# EAGLE design main (EAGLE 8.7.1)
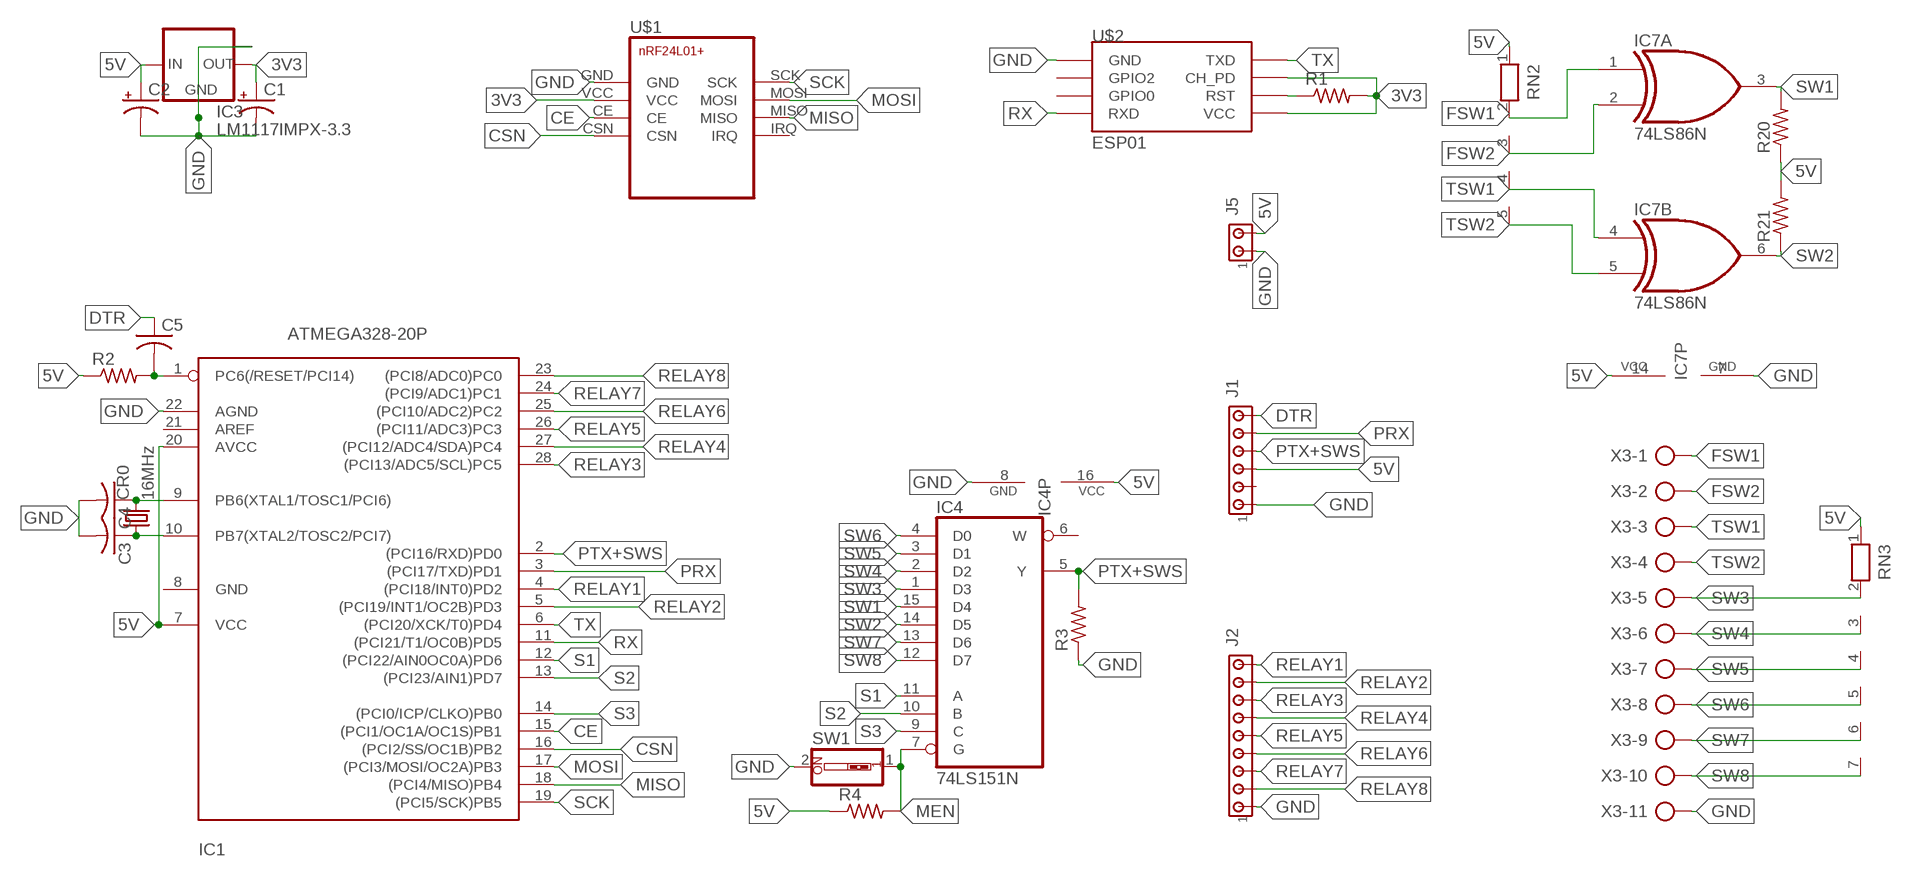
[diagram p0: schematic, sheet 1]

## Parts
C1  CPOL-USE2,5-6E  [E2,5-6E]
C2  CPOL-USE2,5-6E  [E2,5-6E]
C3  C-USC1206  [C1206]
C4  C-USC1206  [C1206]
C5  C-USC1206  [C1206]
CR0  16MHz  CRYSTALHC18U-V  [HC18U-V]
IC1  ATMEGA328-20P  [DIL28-3]
IC3  LM1117IMPX-3.3  [SOT223]
IC4  74LS151N  [DIL16]
IC7  74LS86N  [DIL14]
J1  MTA06-100  [10X06MTA]
J2  MTA09-100  [10X09MTA]
J5  MTA02-100  [10X02MTA]
R1  R-US_R1206  [R1206]
R2  R-US_R1206  [R1206]
R3  R-US_R1206  [R1206]
R4  R-US_R1206  [R1206]
R20  R-US_0204/7  [0204/7]
R21  R-US_R1206  [R1206]
RN2  RN04  [RN-5]
RN3  RN06  [RN-7]
SW1  SW_DIP-1  [EDG-01]
U$1  NRF24L01+  [NRF24L01+]
U$2  ESP01  [ESP01]
X3  AK300/11  [AK300/11]

## Nets
3V3: C1.+ IC3.2(OUT) R1.2 U$1.VCC U$2.CH_PD U$2.VCC
5V: C2.+ IC1.7(VCC) IC1.20(AVCC) IC3.3(IN) IC4.16(VCC) IC7.14(P:VCC) J1.3 J5.2 R2.1 R4.1 R20.1 R21.2 RN2.1 RN3.1
CE: IC1.15((PCI1/OC1A/OC1S)PB1) U$1.CE
CR1: C4.1 CR0.2 IC1.9(PB6(XTAL1/TOSC1/PCI6))
CR2: C3.1 CR0.1 IC1.10(PB7(XTAL2/TOSC2/PCI7))
CSN: IC1.16((PCI2/SS/OC1B)PB2) U$1.CSN
DTR: C5.1 J1.6
ERST: R1.1 U$2.RST
FSW1: IC7.1(A:I0) RN2.2 X3.1
FSW2: IC7.2(A:I1) RN2.3 X3.2
GND: C1.- C2.- C3.2 C4.2 IC1.22(AGND) IC3.1(GND) IC3.TAB(OUT1) IC4.8(GND) IC7.7(P:GND) J1.1 J2.1 J5.1 R3.1 SW1.2 U$1.GND U$2.GND X3.11
MEN: IC4.7(G) R4.2 SW1.1
MISO: IC1.18((PCI4/MISO)PB4) U$1.MISO
MOSI: IC1.17((PCI3/MOSI/OC2A)PB3) U$1.MOSI
MRST: C5.2 IC1.1(PC6(/RESET/PCI14)) R2.2
PRX: IC1.3((PCI17/TXD)PD1) J1.5
PTX+SWS: IC1.2((PCI16/RXD)PD0) IC4.5(Y) J1.4 R3.2
RELAY1: IC1.4((PCI18/INT0)PD2) J2.9
RELAY2: IC1.5((PCI19/INT1/OC2B)PD3) J2.8
RELAY3: IC1.28((PCI13/ADC5/SCL)PC5) J2.7
RELAY4: IC1.27((PCI12/ADC4/SDA)PC4) J2.6
RELAY5: IC1.26((PCI11/ADC3)PC3) J2.5
RELAY6: IC1.25((PCI10/ADC2)PC2) J2.4
RELAY7: IC1.24((PCI9/ADC1)PC1) J2.3
RELAY8: IC1.23((PCI8/ADC0)PC0) J2.2
RX: IC1.11((PCI21/T1/OC0B)PD5) U$2.RX(RXD)
S1: IC1.12((PCI22/AIN0OC0A)PD6) IC4.11(A)
S2: IC1.13((PCI23/AIN1)PD7) IC4.10(B)
S3: IC1.14((PCI0/ICP/CLKO)PB0) IC4.9(C)
SCK: IC1.19((PCI5/SCK)PB5) U$1.SCK
SW1: IC4.15(D4) IC7.3(A:O) R20.2
SW2: IC4.14(D5) IC7.6(B:O) R21.1
SW3: IC4.1(D3) RN3.2 X3.5
SW4: IC4.2(D2) RN3.3 X3.6
SW5: IC4.3(D1) RN3.4 X3.7
SW6: IC4.4(D0) RN3.5 X3.8
SW7: IC4.13(D6) RN3.6 X3.9
SW8: IC4.12(D7) RN3.7 X3.10
TSW1: IC7.4(B:I0) RN2.4 X3.3
TSW2: IC7.5(B:I1) RN2.5 X3.4
TX: IC1.6((PCI20/XCK/T0)PD4) U$2.TX(TXD)
Unconnected: IC1.8(GND) IC1.21(AREF) IC4.6(W) IC7.8(C:O) IC7.9(C:I0) IC7.10(C:I1) IC7.11(D:O) IC7.12(D:I0) IC7.13(D:I1) J1.2 U$1.IRQ U$2.GPIO0 U$2.GPIO2

## Library data of the parts
C1 C2 = adafruit:CPOL-US: POLARIZED CAPACITOR, American symbol
C3-C5 = adafruit:C-US: CAPACITOR, American symbol
CR0 = adafruit:CRYSTAL: CRYSTAL; OC_FARNELL: unknown; OC_NEWARK: unknown
IC1 = atmega328:ATMEGA328*P: MICROCONTROLLER 32 kBytes FLASH 2 kBytes SRAM 1 kBytes EEPROM USART 8-channel 10 bit ADC
IC3 = lm1117:LM1117IMPX-*
IC4 = 74xx-us:74*151: Data SELECTOR/MULTIPLEXER
IC7 = 74xx-us:74*86: Quad 2-input EXCLUSIV-OR (XOR) gate
J1 = con-amp:MTA06-100: AMP connector Connection corrected 2014-09-19
J2 = con-amp:MTA09-100: AMP connector
J5 = con-amp:MTA02-100: AMP connector
R1-R4 R20 R21 = adafruit:R-US_: RESISTOR, American symbol
RN2 = resistor-net:RN04: RESISTOR NETWORK; OC_FARNELL: unknown; OC_NEWARK: unknown
RN3 = resistor-net:RN06: RESISTOR NETWORK; OC_FARNELL: unknown; OC_NEWARK: unknown
SW1 = special:SW_DIP-1: DIP SWITCH
U$1 = nrf24l01:NRF24L01+: nRF24L01+ Transceiver Module
U$2 = esp8266:ESP01: ESP8266 Wifi module 01
X3 = con-ptr500:AK300/11: CONNECTOR; OC_FARNELL: unknown; OC_NEWARK: unknown

## Board
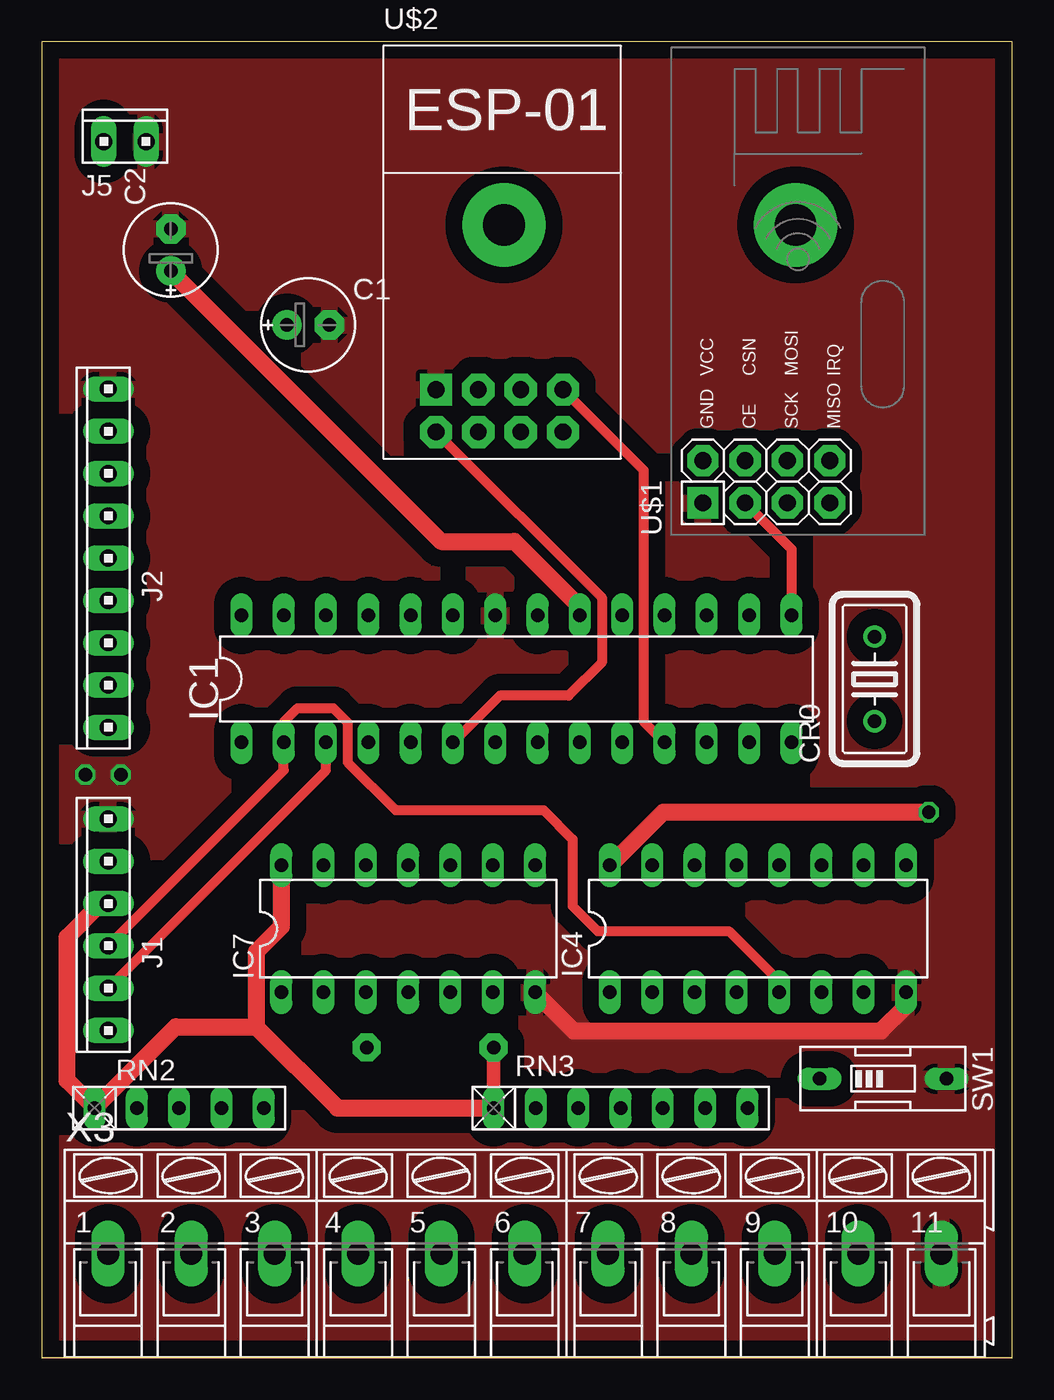
[diagram p1: board, top side]
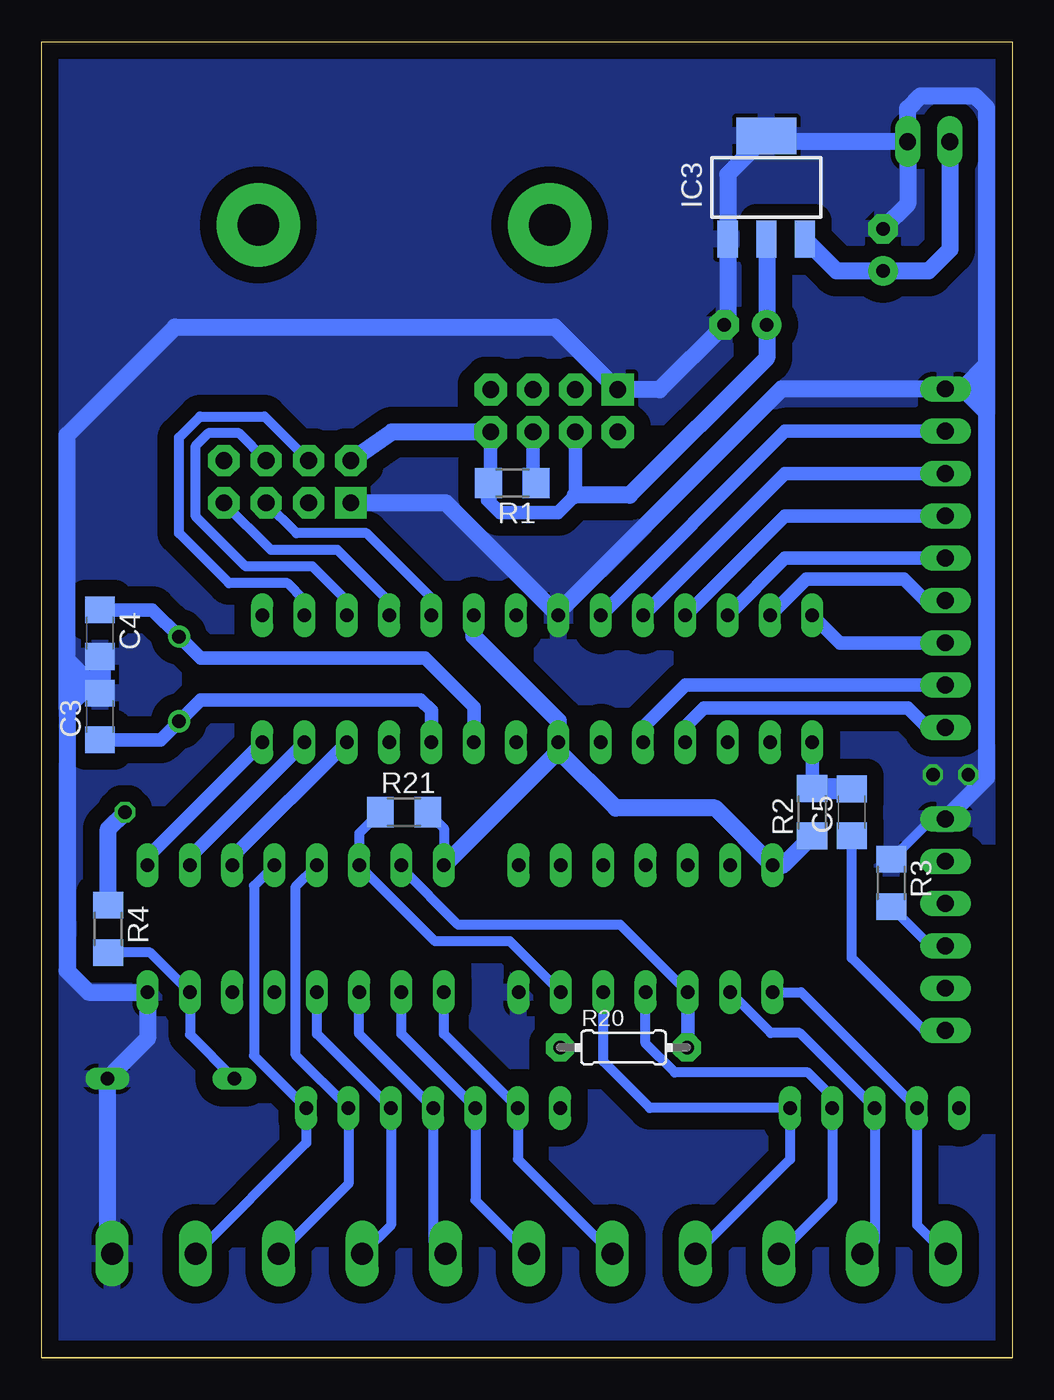
[diagram p2: board, bottom side, seen from below]

Size 58.25 x 79 mm. Coordinates in mm from the lower left corner, seen from the top.
Outline: 0,0 58.25,0
Outline: 58.25,0 0,0
Outline: 58.25,0 58.25,79 0,79 0,0
Copper layers (1*16): Top 0.035mm / dielectric 1.5mm / Bottom 0.035mm
Design rules "default": minimum track width 6mil, minimum drill 0.35mm, track to track 6mil, track to pad 6mil, pad to pad 6mil, via to via 6mil, smd to smd 6mil, copper to edge 40mil, drill to drill 6mil, minimum pad ring 10mil, minimum via ring 8mil, stop-mask expansion 4mil, vias tented up to drill 0mil, thermal gap 10mil

### Footprints (pad centres in the part's own frame; a part is rotated, then mirrored left to right if it is on the bottom)
E2,5-6E = drill 0.813 pad 1.778: + -1.27,0 | drill 0.813 pad 1.778 octagon: - 1.27,0
C1206 = smd 1.6 x 1.8: 1 -1.4,0; 2 1.4,0
HC18U-V = drill 0.813: 1 -2.54,0; 2 2.54,0
DIL28-3 = drill 0.813 long: 1 -16.51,-3.81; 2 -13.97,-3.81; 3 -11.43,-3.81; 4 -8.89,-3.81; 5 -6.35,-3.81; 6 -3.81,-3.81; 7 -1.27,-3.81; 8 1.27,-3.81; 9 3.81,-3.81; 10 6.35,-3.81; 11 8.89,-3.81; 12 11.43,-3.81; 13 13.97,-3.81; 14 16.51,-3.81; 15 16.51,3.81; 16 13.97,3.81; 17 11.43,3.81; 18 8.89,3.81; 19 6.35,3.81; 20 3.81,3.81; 21 1.27,3.81; 22 -1.27,3.81; 23 -3.81,3.81; 24 -6.35,3.81; 25 -8.89,3.81; 26 -11.43,3.81; 27 -13.97,3.81; 28 -16.51,3.81
SOT223 = smd 1.219 x 2.235: 1 -2.311,-3.099; 2 0,-3.099; 3 2.311,-3.099 | smd 3.6 x 2.2: TAB 0,3.099
DIL16 = drill 0.813 long: 1 -8.89,-3.81; 2 -6.35,-3.81; 3 -3.81,-3.81; 4 -1.27,-3.81; 5 1.27,-3.81; 6 3.81,-3.81; 7 6.35,-3.81; 8 8.89,-3.81; 9 8.89,3.81; 10 6.35,3.81; 11 3.81,3.81; 12 1.27,3.81; 13 -1.27,3.81; 14 -3.81,3.81; 15 -6.35,3.81; 16 -8.89,3.81
DIL14 = drill 0.813 long: 1 -7.62,-3.81; 2 -5.08,-3.81; 3 -2.54,-3.81; 4 0,-3.81; 5 2.54,-3.81; 6 5.08,-3.81; 7 7.62,-3.81; 8 7.62,3.81; 9 5.08,3.81; 10 2.54,3.81; 11 0,3.81; 12 -2.54,3.81; 13 -5.08,3.81; 14 -7.62,3.81
10X06MTA = drill 1.016 long: 1 6.35,0; 2 3.81,0; 3 1.27,0; 4 -1.27,0; 5 -3.81,0; 6 -6.35,0
10X09MTA = drill 1.016 long: 1 10.16,0; 2 7.62,0; 3 5.08,0; 4 2.54,0; 5 0,0; 6 -2.54,0; 7 -5.08,0; 8 -7.62,0; 9 -10.16,0
10X02MTA = drill 1.016 long: 1 1.27,0; 2 -1.27,0
R1206 = smd 1.6 x 1.803: 1 -1.422,0; 2 1.422,0
0204/7 = drill 0.813 pad 1.676 octagon: 1 -3.81,0; 2 3.81,0
RN-5 = drill 0.813 long: 1 -5.08,0; 2 -2.54,0; 3 0,0; 4 2.54,0; 5 5.08,0
RN-7 = drill 0.813 long: 1 -7.62,0; 2 -5.08,0; 3 -2.54,0; 4 0,0; 5 2.54,0; 6 5.08,0; 7 7.62,0
EDG-01 = drill 0.813 long: 1 0,-3.81; 2 0,3.81
NRF24L01+ = drill 1.016 pad 1.88 octagon: CE -11.43,1.27; CSN -8.89,1.27; IRQ -8.89,-3.81; MISO -11.43,-3.81; MOSI -8.89,-1.27; SCK -11.43,-1.27; VCC -8.89,3.81 | drill 1.016 pad 1.88 square: GND -11.43,3.81
ESP01 = drill 1 pad 1.93 octagon: CH_PD -1.285,-8.178; GPIO0 1.255,-5.638; GPIO2 -1.285,-5.638; RST 1.255,-8.178; RX 3.795,-5.638; TX -3.825,-8.178; VCC 3.795,-8.178 | drill 1 pad 1.93 square: GND -3.825,-5.638
AK300/11 = drill 1.321 long: 1 -25.019,0; 2 -20.015,0; 3 -15.011,0; 4 -10.008,0; 5 -5.004,0; 6 0,0; 7 5.004,0; 8 10.008,0; 9 15.011,0; 10 20.015,0; 11 25.019,0

### Placement (x,y rotation side)
C1  16,62 0 top
C2  7.75,66.5 90 top
C3  54.75,38.5 90 bottom
C4  54.75,43.5 270 bottom
C5  9.62,32.75 90 bottom
CR0  50,40.75 90 top
IC1  28.5,40.75 0 top
IC3  14.75,70.25 0 bottom
IC4  43,25.75 0 top
IC7  22,25.75 0 top
J1  4,26 90 top
J2  4,48 90 top
J5  5,73 0 top
R1  30,52.5 180 bottom
R2  12,32.75 90 bottom
R3  7.25,28.5 270 bottom
R4  54.25,25.75 270 bottom
R20  23.32,18.62 0 bottom
R21  36.5,32.75 0 bottom
RN2  8.25,15 0 top
RN3  34.75,15 0 top
SW1  50.5,16.75 270 top
U$1  43.5,62.75 90 top
U$2  27.5,63.75 0 top
X3  29,6.25 0 top

### Tracks (layer width: path | path; a pad name or v marks a point on that pad's centre or on a via)
3V3
  Bottom 0.813: U$2.VCC 31.3,52.38 | 31.3,52.38 R1.2 | U$2.CH_PD 26.21,51.78 27.25,50.75 30.75,50.75 31.5,51.5 31.3,51.7 31.3,52.38
  Bottom 1.016: IC3.2 14.73,67.13 C1.+ 14.73,60.02 22.96,51.78 26.21,51.78 | U$2.VCC 37.23,55.57 U$1.VCC
5V  (via drill 0.8)
  Top 0.813: R20.1 RN3.1
  Top 1.016: v53.25,32.75 37.3,32.75 IC4.16 | 12.88,19.88 17.75,15 RN3.1 | C2.+ 23.98,49 28.38,49 32.31,45.06 IC1.20 | IC7.14 14.38,25.88 12.88,24.38 12.88,19.88 | J1.3 3.54,27.27 1.52,25.25 1.52,16.65 RN2.1 8.04,19.88 12.88,19.88
  Bottom 0.61: R21.2 34.11,31.78 IC4.16
  Bottom 1.016: J5.2 3.73,66.52 5.02,65.23 C2.+ 10.52,65.23 IC3.3 | R2.1 13.77,29.56 IC7.14 17.82,33 23.79,33 27.23,36.44 | IC1.20 32.31,43.31 27.23,38.23 IC1.7 27.23,36.44 | 27.23,36.44 IC4.16 | R4.1 54.25,31.75 v53.25,32.75
CE
  Top 0.61: U$1.CE 45.01,48.54 IC1.15
CR1
  Bottom 0.813: C4.1 51.61,44.9 CR0.2 48.71,42 35.25,42 32.31,39.06 IC1.9
CR2
  Bottom 0.813: C3.1 51.11,37.1 CR0.1 48.71,39.5 35.5,39.5 34.85,38.85 IC1.10
CSN
  Bottom 0.61: IC1.16 42.47,45.47 43.5,46.5 47,46.5 50,49.5 50,55.25 48.75,56.5 44.87,56.5 U$1.CSN
DTR
  Bottom 0.61: J1.6 5.28,19.65 9.62,24 C5.1
ERST
  Bottom 0.813: U$2.RST 28.75,52.43 R1.1
FSW1
  Bottom 0.61: X3.1 5.71,7.98 RN2.2 12.65,21.94 IC7.1
FSW2
  Bottom 0.61: X3.2 8.25,6.99 RN2.3 12.75,19.5 14.48,19.5 IC7.2
GND  (via drill 0.8)
  Top 1.016: IC7.7 31.93,19.62 50.38,19.62 51.89,21.14 IC4.8
  Bottom 0.61: J1.1 4.82,32.35 R3.1
  Bottom 1.016: J5.1 6.27,69.25 C2.- | J5.1 14.4,73 IC3.TAB 17.06,71.04 IC3.1 17.06,62.21 C1.- 21.16,58.11 U$2.GND 27.44,61.88 50.25,61.88 56.73,55.4 56.73,41.88 | X3.11 54.31,6.54 SW1.2 51.89,19.17 IC4.8 55.44,21.94 56.73,23.23 56.73,39.02 | J5.1 6.27,74.98 5.5,75.75 2.25,75.75 1.52,75.02 1.52,59.64 | 54.75,41 56.73,39.02 | J1.1 1.52,34.83 1.52,56.75 | 1.52,56.75 1.52,58.25 | 1.52,58.25 1.52,59.64 | J2.1 3,58.16 | 3,58.16 1.61,58.16 1.52,58.25 | 1.52,59.64 3,58.16 | J2.1 2.93,58.16 1.52,56.75 | J2.1 13.84,58.16 27.23,44.77 | U$1.GND 33.99,51.32 IC1.22 | 56.73,39.02 56.73,40.5 | 56.73,40.5 56.73,41.88 | 56.73,41.88 C3.2 55.35,40.5 56.73,40.5
  Bottom 1.27: C4.2 54.75,41 C3.2
  other vias: 2.62,35 4.75,35
  pour Bottom (isolate 1): 0,79 58.25,79 58.25,0 0,0
  pour Top (isolate 1): 0,79 58.25,79 58.25,0 0,0
MEN
  Bottom 0.61: SW1.1 49.35,19.41 IC4.7 51.74,24.33 R4.2
MISO
  Bottom 0.61: IC1.18 37.39,45.39 40.5,48.5 44.49,48.5 U$1.MISO
MOSI
  Bottom 0.61: U$1.MOSI 46.41,55.5 48.25,55.5 49,54.75 49,50.5 46,47.5 42,47.5 39.93,45.43 IC1.17
MRST
  Bottom 0.61: 11.96,34.15 11.99,34.18
  Bottom 0.813: R2.2 11.99,34.18 IC1.1
  Bottom 1.27: C5.2 11.96,34.15
N$26  (via drill 2.5 pad 5)
  other vias: 27.75,68
N$47  (via drill 2.5 pad 5)
  other vias: 45.25,68
PRX
  Top 0.61: J1.5 17.07,35.26 IC1.3
PTX+SWS
  Top 0.61: IC4.5 44.12,22.09 44.12,22.75 41.25,25.62 33.38,25.62 31.88,27.12 31.88,31.12 30.12,32.88 21.25,32.88 18.38,35.75 18.38,38.12 17.5,39 15.38,39 14.53,38.16 IC1.2 14.53,35.26 J1.4
  Bottom 0.61: J1.4 4.9,24.73 R3.2
RELAY1
  Bottom 0.813: J2.9 5.09,37.84 6.25,39 18.5,39 19.75,37.75 19.61,37.61 IC1.4
RELAY2
  Bottom 0.813: J2.8 19.62,40.38 22.15,37.85 IC1.5
RELAY3
  Bottom 0.813: J2.7 10.35,42.92 IC1.28
RELAY4
  Bottom 0.813: IC1.27 12.34,46.75 6.5,46.75 5.21,45.46 J2.6
RELAY5
  Bottom 0.813: J2.5 13.63,48 IC1.26
RELAY6
  Bottom 0.813: J2.4 13.63,50.54 IC1.25
RELAY7
  Bottom 0.813: J2.3 13.63,53.08 IC1.24
RELAY8
  Bottom 0.813: J2.2 13.63,55.62 IC1.23
RX
  Top 0.61: U$2.RX 36.12,53.28 36.12,38.2 IC1.11
S1
  Bottom 0.813: IC1.12 46.81,30.06 IC4.11
S2
  Bottom 0.813: IC1.13 49.35,30.06 IC4.10
S3
  Bottom 0.813: IC1.14 51.89,30.06 IC4.9
SCK
  Bottom 0.61: IC1.19 34.85,45.6 38.75,49.5 42.95,49.5 U$1.SCK
SW1
  Bottom 0.61: IC7.3 23.52,26 33.25,26 36.65,29.4 IC4.15
  Bottom 0.813: IC7.3 19.46,18.68 R20.2
SW2
  Bottom 0.61: R21.1 39.19,31.48 IC4.14 34.63,25 30.14,25 IC7.6
SW3
  Bottom 0.61: X3.5 29.67,11.92 RN3.2 34.11,19.44 IC4.1
SW4
  Bottom 0.61: X3.6 32.21,9.46 RN3.3 36.65,19.44 IC4.2
SW5
  Bottom 0.61: X3.7 34.75,7 RN3.4 39.19,19.44 IC4.3
SW6
  Bottom 0.61: X3.8 37.29,7.97 RN3.5 41.73,19.44 IC4.4
SW7
  Bottom 0.61: X3.9 39.83,10.43 RN3.6 43,18.17 43,28.29 IC4.13
SW8
  Bottom 0.61: X3.10 42.37,12.89 RN3.7 45.5,18.13 45.5,28.33 IC4.12
TSW1
  Bottom 0.61: X3.3 10.79,9.45 RN2.4 10.79,15.66 12.25,17.12 20.25,17.12 22,18.88 IC7.4
TSW2
  Bottom 0.61: X3.4 13.33,11.91 RN2.5 21.75,15 24.54,17.79 IC7.5
TX
  Top 0.61: U$2.TX 33.62,45.62 33.62,41.75 31.62,39.75 27.5,39.75 IC1.6